# Altium project Voltage supply of sEMG & ADC.PrjPcb
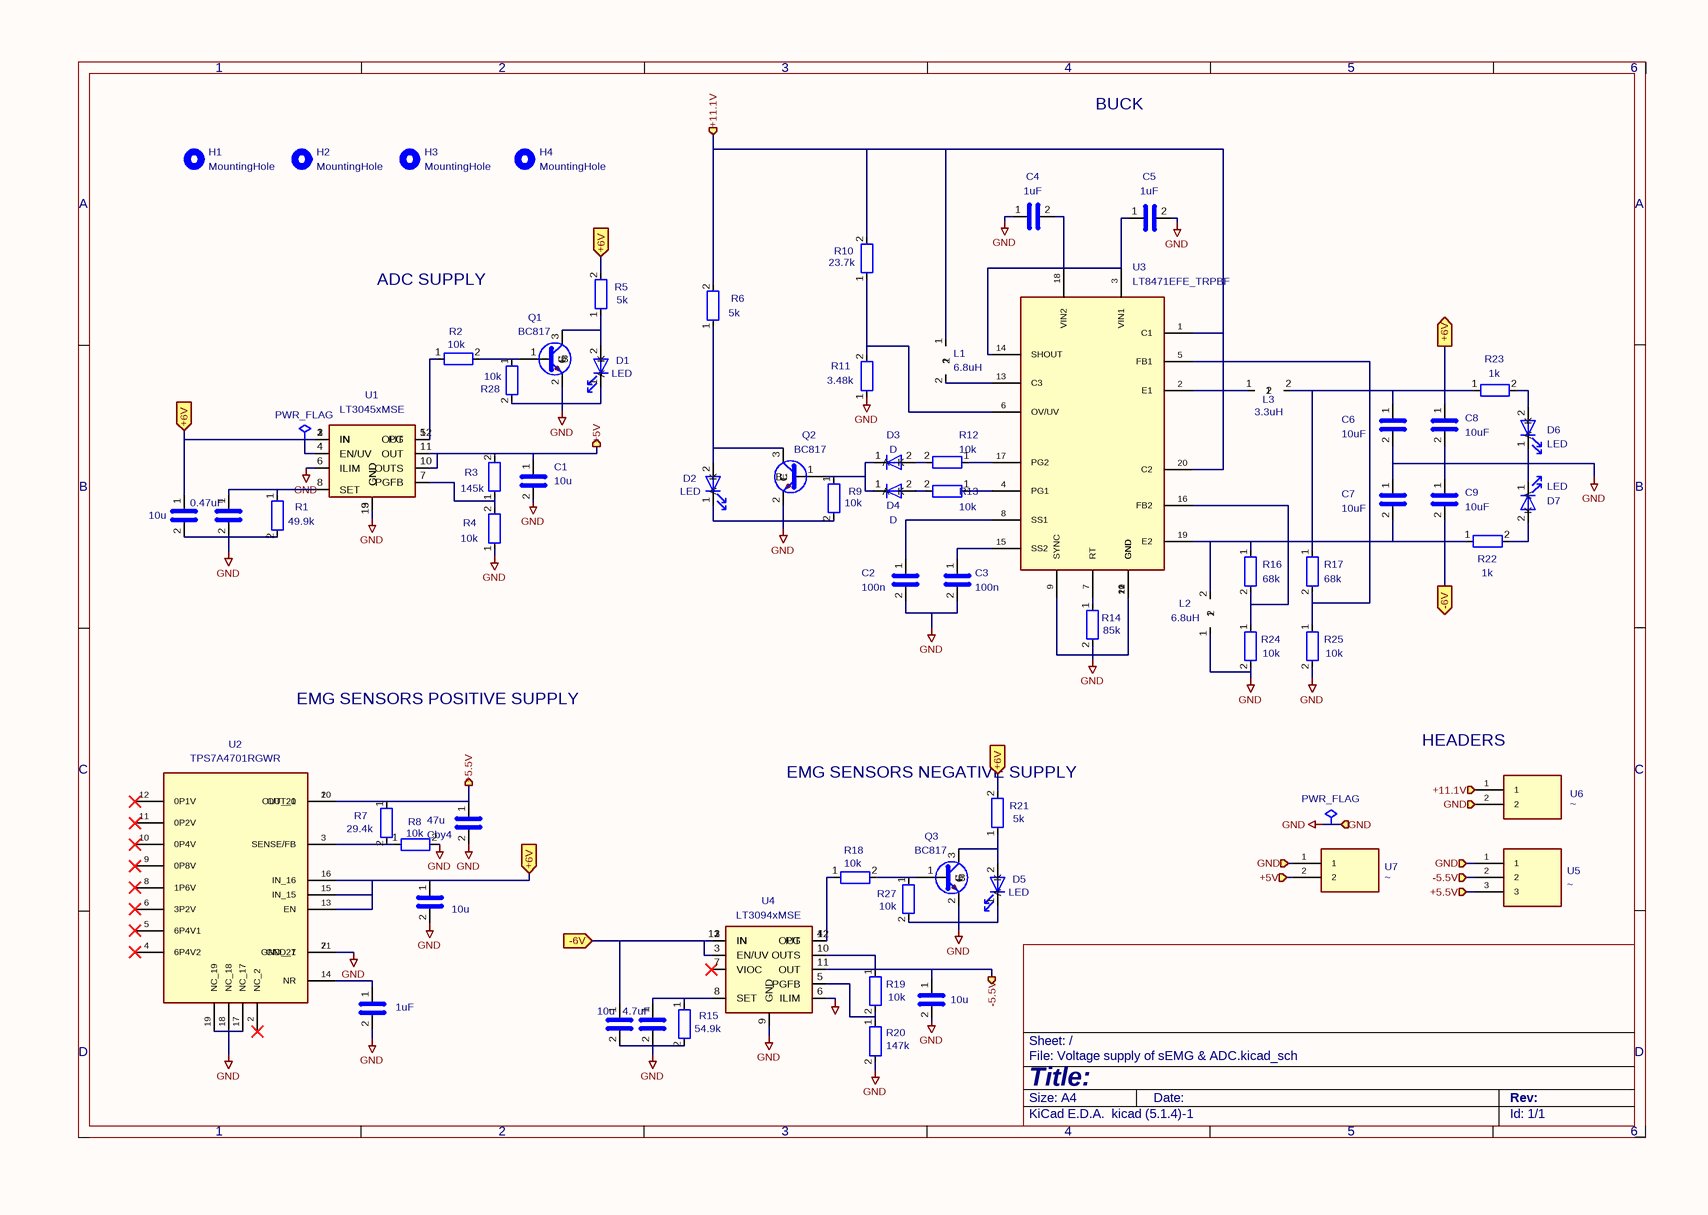
[diagram p0: Voltage supply of sEMG & ADC.SchDoc]
4 sheets, 189 parts. Net scope: flat (ports and power ports of the same name join across sheets).
Board files: Voltage supply of sEMG & ADC.PcbDoc, Voltage supply of sEMG & ADC(1).PcbDoc, ADC.PcbDoc, ADC(1).PcbDoc, BMS.PcbDoc, BMS(1).PcbDoc, EMG sensors.PcbDoc, EMG sensors(1).PcbDoc
Sheets:
  Voltage supply of sEMG & ADC.SchDoc
  ADC.SchDoc
  BMS.SchDoc
  EMG sensors.SchDoc

## Sheet Voltage supply of sEMG & ADC.SchDoc
size 297 x 209 mm

### Parts
(Parts that share a designator on the sheet are numbered #1, #2 ... from top to bottom, then left to right.)
#FLG01#1  PWR_FLAG  (graphical)
#FLG02#1  PWR_FLAG  (graphical)
C1#1  10u  [C_0805_2012Metric_Pad1.18x1.45mm_HandSolder]
C2#1  100n  [C_0402_1005Metric_Pad0.74x0.62mm_HandSolder]
C2in1  1uF  [C_0402_1005Metric_Pad0.74x0.62mm_HandSolder]
C3#1  100n  [C_0402_1005Metric_Pad0.74x0.62mm_HandSolder]
C4#1  1uF  [C_0603_1608Metric_Pad1.08x0.95mm_HandSolder]
C5#1  1uF  [C_0603_1608Metric_Pad1.08x0.95mm_HandSolder]
C6#1  10uF  [C_0805_2012Metric_Pad1.18x1.45mm_HandSolder]
C7#1  10uF  [C_0805_2012Metric_Pad1.18x1.45mm_HandSolder]
C8#1  10uF  [C_0805_2012Metric_Pad1.18x1.45mm_HandSolder]
C9#1  10uF  [C_0805_2012Metric_Pad1.18x1.45mm_HandSolder]
Cby1  10u  [C_0805_2012Metric_Pad1.18x1.45mm_HandSolder]
Cby2  0.47uF  [C_0805_2012Metric_Pad1.18x1.45mm_HandSolder]
Cby3  10u  [C_0805_2012Metric_Pad1.18x1.45mm_HandSolder]
Cby4  47u  [C_1210_3225Metric_Pad1.33x2.70mm_HandSolder]
Cby5  10u  [C_0805_2012Metric_Pad1.18x1.45mm_HandSolder]
Cby6  4.7uF  [C_0805_2012Metric_Pad1.18x1.45mm_HandSolder]
Cby7  10u  [C_0805_2012Metric_Pad1.18x1.45mm_HandSolder]
D1#1  LED  [LED_0603_1608Metric_Pad1.05x0.95mm_HandSolder]
D2#1  LED  [LED_0603_1608Metric_Pad1.05x0.95mm_HandSolder]
D3#1  D  [D_SOD-123]
D4  D  [D_SOD-123]
D5  LED  [LED_0603_1608Metric_Pad1.05x0.95mm_HandSolder]
D6  LED  [LED_0603_1608Metric_Pad1.05x0.95mm_HandSolder]
D7  LED  [LED_0603_1608Metric_Pad1.05x0.95mm_HandSolder]
H1#1  MountingHole  [MountingHole_2.7mm_M2.5_DIN965]
H2#1  MountingHole  [MountingHole_2.7mm_M2.5_DIN965]
H3#1  MountingHole  [MountingHole_2.7mm_M2.5_DIN965]
H4#1  MountingHole  [MountingHole_2.7mm_M2.5_DIN965]
L1  6.8uH  [L_Coilcraft_XAL7030-102]
L2  6.8uH  [L_Coilcraft_XAL7030-102]
L3  3.3uH  [L_Coilcraft_XAL5030-XXX]
Q1#1  BC817  [SOT-23]
Q2#1  BC817  [SOT-23]
Q3#1  BC817  [SOT-23]
R1#1  49.9k  [R_0603_1608Metric_Pad0.98x0.95mm_HandSolder]
R2#1  10k  [R_0402_1005Metric_Pad0.72x0.64mm_HandSolder]
R3#1  145k  [R_0603_1608Metric_Pad0.98x0.95mm_HandSolder]
R4#1  10k  [R_0402_1005Metric_Pad0.72x0.64mm_HandSolder]
R5#1  5k  [R_0603_1608Metric_Pad0.98x0.95mm_HandSolder]
R6#1  5k  [R_0603_1608Metric_Pad0.98x0.95mm_HandSolder]
R7#1  29.4k  [R_0402_1005Metric_Pad0.72x0.64mm_HandSolder]
R8#1  10k  [R_0402_1005Metric_Pad0.72x0.64mm_HandSolder]
R9#1  10k  [R_0402_1005Metric_Pad0.72x0.64mm_HandSolder]
R10#1  23.7k  [R_0402_1005Metric_Pad0.72x0.64mm_HandSolder]
R11#1  3.48k  [R_0603_1608Metric_Pad0.98x0.95mm_HandSolder]
R12#1  10k  [R_0402_1005Metric_Pad0.72x0.64mm_HandSolder]
R13#1  10k  [R_0402_1005Metric_Pad0.72x0.64mm_HandSolder]
R14#1  85k  [R_0603_1608Metric_Pad0.98x0.95mm_HandSolder]
R15#1  54.9k  [R_0603_1608Metric_Pad0.98x0.95mm_HandSolder]
R16#1  68k  [R_0603_1608Metric_Pad0.98x0.95mm_HandSolder]
R17#1  68k  [R_0603_1608Metric_Pad0.98x0.95mm_HandSolder]
R18#1  10k  [R_0402_1005Metric_Pad0.72x0.64mm_HandSolder]
R19#1  10k  [R_0402_1005Metric_Pad0.72x0.64mm_HandSolder]
R20  147k  [R_0603_1608Metric_Pad0.98x0.95mm_HandSolder]
R21  5k  [R_0603_1608Metric_Pad0.98x0.95mm_HandSolder]
R22  1k  [R_0603_1608Metric_Pad0.98x0.95mm_HandSolder]
R23  1k  [R_0603_1608Metric_Pad0.98x0.95mm_HandSolder]
R24  10k  [R_0603_1608Metric_Pad0.98x0.95mm_HandSolder]
R25  10k  [R_0603_1608Metric_Pad0.98x0.95mm_HandSolder]
R27  10k  [R_0603_1608Metric_Pad0.98x0.95mm_HandSolder]
R28  10k  [R_0603_1608Metric_Pad0.98x0.95mm_HandSolder]
U1#1  LT3045xMSE  [MSOP-12-1EP_3x4.039mm_P0.65mm_EP1.651x2.845mm]
U2#1  TPS7A4701RGWR  [QFN65P500X500X100-21N]
U3#1  LT8471EFE_TRPBF  [SOP65P640X120-21N]
U4#1  LT3094xMSE  [MSOP-12-1EP_3x4.039mm_P0.65mm_EP1.651x2.845mm]
U5#1  ~  [JST_GH_SM03B-GHS-TB_1x03-1MP_P1.25mm_Horizontal]
U6#1  ~  [JST_GH_SM02B-GHS-TB_1x02-1MP_P1.25mm_Horizontal]
U7#1  ~  [JST_GH_SM02B-GHS-TB_1x02-1MP_P1.25mm_Horizontal]

### Ports
+5.5V (in), +5.5V (out), +5V (in), +5V (out), +6V (in), +6V (out), +11.1V (in), +11.1V (out), -5.5V (in), -5.5V (out), -6V (in), -6V (out), GND (in), GND (out)

### Nets
GND: #FLG01#1.1 C1#1.2 C2#1.2 C2in1.2 C3#1.2 C4#1.1 C5#1.2 C6#1.2 C7#1.1 C8#1.2 C9#1.1 Cby1.2 Cby2.2 Cby3.2 Cby4.2 Cby5.2 Cby6.2 Cby7.2 D1#1.1(K) D2#1.1(K) D5.1(K) D6.1(K) D7.1(K) L2.1 Q1#1.2(E) Q2#1.2(E) Q3#1.2(E) R1#1.2 R4#1.1 R8#1.2 R9#1.2 R11#1.1 R14#1.2 R15#1.2 R20.2 R24.2 R25.2 R27.2 R28.2 U1#1.6(ILIM) U1#1.9(GND) U1#1.13(GND) U2#1.7(GND_7) U2#1.17(NC_17) U2#1.18(NC_18) U2#1.19(NC_19) U2#1.21(GND_21) U3#1.9(SYNC) U3#1.10(GND) U3#1.11(GND) U3#1.12(GND) U3#1.21(GND) U4#1.6(ILIM) U4#1.9(GND) U5#1.1 U6#1.2 U7#1.1 ; port GND
+5.5V: Cby4.1 R7#1.1 U2#1.1(OUT_1) U2#1.20(OUT_20) U5#1.3 ; port +5.5V
+5V: C1#1.1 R3#1.2 U1#1.10(OUTS) U1#1.11(OUT) U7#1.2 ; port +5V
+6V: #FLG02#1.1 C6#1.1 C8#1.1 Cby1.1 Cby3.1 L3.2 R5#1.2 R17#1.1 R21.2 R23.1 U1#1.1(IN) U1#1.2(IN) U1#1.3(IN) U1#1.4(EN/UV) U2#1.13(EN) U2#1.15(IN_15) U2#1.16(IN_16) ; port +6V
+11.1V: L1.1 R6#1.2 R10#1.2 U3#1.1(C1) U3#1.20(C2) U6#1.1 ; port +11.1V
-5.5V: Cby7.1 R19#1.1 U4#1.10(OUTS) U4#1.11(OUT) U5#1.2 ; port -5.5V
-6V: C7#1.2 C9#1.2 Cby5.1 L2.2 R16#1.1 R22.1 U3#1.19(E2) U4#1.1(IN) U4#1.2(IN) U4#1.3(EN/UV) U4#1.13(IN) ; port -6V
NetC2#1_1: C2#1.1 U3#1.8(SS1)
NetC2in1_1: C2in1.1 U2#1.14(NR)
NetC3#1_1: C3#1.1 U3#1.15(SS2)
NetC4#1_2: C4#1.2 C5#1.1 U3#1.3(VIN1) U3#1.14(SHOUT) U3#1.18(VIN2)
NetCby2_1: Cby2.1 R1#1.1 U1#1.8(SET)
NetCby6_1: Cby6.1 R15#1.1 U4#1.8(SET)
NetD1#1_2: D1#1.2(A) Q1#1.3(C) R5#1.1
NetD2#1_2: D2#1.2(A) Q2#1.3(C) R6#1.1
NetD3#1_1: D3#1.1(K) D4.1(K) Q2#1.1(B) R9#1.1
NetD3#1_2: D3#1.2(A) R12#1.2
NetD4_2: D4.2(A) R13#1.2
NetD5_2: D5.2(A) Q3#1.3(C) R21.1
NetD6_2: D6.2(A) R23.2
NetD7_2: D7.2(A) R22.2
NetL1_2: L1.2 U3#1.13(C3)
NetL3_1: L3.1 U3#1.2(E1)
NetQ1#1_1: Q1#1.1(B) R2#1.2 R28.1
NetQ3#1_1: Q3#1.1(B) R18#1.2 R27.1
NetR2#1_1: R2#1.1 U1#1.5(PG) U1#1.12(OUT)
NetR3#1_1: R3#1.1 R4#1.2 U1#1.7(PGFB)
NetR7#1_2: R7#1.2 R8#1.1 U2#1.3(SENSE/FB)
NetR10#1_1: R10#1.1 R11#1.2 U3#1.6(OV/UV)
NetR12#1_1: R12#1.1 U3#1.17(PG2)
NetR13#1_1: R13#1.1 U3#1.4(PG1)
NetR14#1_1: R14#1.1 U3#1.7(RT)
NetR16#1_2: R16#1.2 R24.1 U3#1.16(FB2)
NetR17#1_2: R17#1.2 R25.1 U3#1.5(FB1)
NetR18#1_1: R18#1.1 U4#1.4(PG) U4#1.12(OUT)
NetR19#1_2: R19#1.2 R20.1 U4#1.5(PGFB)

Not connected (* = marked no-connect by the designer): U2#1 2(NC_2)* 4(6P4V2)* 5(6P4V1)* 6(3P2V)* 8(1P6V)* 9(0P8V)* 10(0P4V)* 11(0P2V)* 12(0P1V)*; U4#1 7(VIOC)*

### Notes on the sheet
- BUCK
- ADC SUPPLY
- EMG SENSORS POSITIVE SUPPLY
- (near R21) EMG SENSORS NEGATIVE SUPPLY
- (near U6#1) HEADERS
- 1
- 2
- 3
- 4
- 5
- 6
- A
- B
- C
- D
- Title:
- File: Voltage supply of sEMG & ADC.kicad_sch
- Sheet: /
- KiCad E.D.A.  kicad (5.1.4)-1
- Size: A4
- Date:
- Rev:
- Id: 1/1

### Library data of the parts
#FLG01#1 #FLG02#1 = PWR_FLAG: Description: Special symbol for telling ERC where power comes from; Value: PWR_FLAG
C1#1 C2#1 C2in1 C3#1 C4#1 C5#1 C6#1 C7#1 C8#1 C9#1 Cby1-Cby7 = C: Description: Unpolarized capacitor
  C1#1 Cby1 Cby3 Cby5 Cby7: Value: 10u; Footprint: Capacitor_SMD:C_0805_2012Metric_Pad1.18x1.45mm_HandSolder
  C2#1 C3#1: Value: 100n; Footprint: Capacitor_SMD:C_0402_1005Metric_Pad0.74x0.62mm_HandSolder
  C2in1: Value: 1uF; Footprint: Capacitor_SMD:C_0402_1005Metric_Pad0.74x0.62mm_HandSolder
  C4#1 C5#1: Value: 1uF; Footprint: Capacitor_SMD:C_0603_1608Metric_Pad1.08x0.95mm_HandSolder
  C6#1 C7#1 C8#1 C9#1: Value: 10uF; Footprint: Capacitor_SMD:C_0805_2012Metric_Pad1.18x1.45mm_HandSolder
  Cby2: Value: 0.47uF; Footprint: Capacitor_SMD:C_0805_2012Metric_Pad1.18x1.45mm_HandSolder
  Cby4: Value: 47u; Footprint: Capacitor_SMD:C_1210_3225Metric_Pad1.33x2.70mm_HandSolder
  Cby6: Value: 4.7uF; Footprint: Capacitor_SMD:C_0805_2012Metric_Pad1.18x1.45mm_HandSolder
D1#1 D2#1 D5-D7 = LED: Description: Light emitting diode; Value: LED; Footprint: LED_SMD:LED_0603_1608Metric_Pad1.05x0.95mm_HandSolder
D3#1 D4 = D: Description: Diode; Sim.Pins: 1=K 2=A; Sim.Device: D; Value: D; Footprint: Diode_SMD:D_SOD-123
H1#1 H2#1 H3#1 H4#1 = MountingHole: Description: Mounting Hole without connection; Value: MountingHole; Footprint: MountingHole:MountingHole_2.7mm_M2.5_DIN965
L1-L3 = L: Description: Inductor
  L1: Website: https://www.digikey.com/en/products/detail/coilcraft/LPS4018-682MRC/12714582; Value: 6.8uH; Footprint: Inductor_SMD:L_Coilcraft_XAL7030-102
  L2: Website: https://www.digikey.com/en/products/detail/w%C3%BCrth-elektronik/74437324068/2791049; Value: 6.8uH; Footprint: Inductor_SMD:L_Coilcraft_XAL7030-102
  L3: Website: https://www.digikey.com/en/products/detail/w%C3%BCrth-elektronik/74437324033/2791046; Value: 3.3uH; Footprint: Inductor_SMD:L_Coilcraft_XAL5030-XXX
Q1#1 Q2#1 Q3#1 = BC817: Description: 0.8A Ic, 45V Vce, NPN Transistor, SOT-23; Value: BC817; Footprint: Package_TO_SOT_SMD:SOT-23
R1#1 R2#1 R3#1 R4#1 R5#1 R6#1 R7#1 R8#1 R9#1 R10#1 R11#1 R12#1 R13#1 R14#1 R15#1 R16#1 R17#1 R18#1 R19#1 R20-R25 R27 R28 = R: Description: Resistor
  R1#1: Value: 49.9k; Footprint: Resistor_SMD:R_0603_1608Metric_Pad0.98x0.95mm_HandSolder
  R2#1 R4#1 R8#1 R9#1 R12#1 R13#1 R18#1 R19#1: Value: 10k; Footprint: Resistor_SMD:R_0402_1005Metric_Pad0.72x0.64mm_HandSolder
  R3#1: Value: 145k; Footprint: Resistor_SMD:R_0603_1608Metric_Pad0.98x0.95mm_HandSolder
  R5#1 R6#1 R21: Value: 5k; Footprint: Resistor_SMD:R_0603_1608Metric_Pad0.98x0.95mm_HandSolder
  R7#1: Value: 29.4k; Footprint: Resistor_SMD:R_0402_1005Metric_Pad0.72x0.64mm_HandSolder
  R10#1: Website: https://www.digikey.be/en/products/detail/stackpole-electronics-inc/RMCF0402FT23K7/1714563; Value: 23.7k; Footprint: Resistor_SMD:R_0402_1005Metric_Pad0.72x0.64mm_HandSolder
  R11#1: Website: https://www.digikey.in/en/products/detail/yageo/RC0402FR-073K48L/5281008; Value: 3.48k; Footprint: Resistor_SMD:R_0603_1608Metric_Pad0.98x0.95mm_HandSolder
  R14#1: Value: 85k; Footprint: Resistor_SMD:R_0603_1608Metric_Pad0.98x0.95mm_HandSolder
  R15#1: Value: 54.9k; Footprint: Resistor_SMD:R_0603_1608Metric_Pad0.98x0.95mm_HandSolder
  R16#1 R17#1: Website: https://www.digikey.com/en/products/detail/susumu/RG1608P-683-B-T5/1228890; Value: 68k; Footprint: Resistor_SMD:R_0603_1608Metric_Pad0.98x0.95mm_HandSolder
  R20: Value: 147k; Footprint: Resistor_SMD:R_0603_1608Metric_Pad0.98x0.95mm_HandSolder
  R22 R23: Value: 1k; Footprint: Resistor_SMD:R_0603_1608Metric_Pad0.98x0.95mm_HandSolder
  R24 R25 R27 R28: Website: https://www.digikey.lv/en/products/detail/panasonic-electronic-components/ERA-3AEB103V/1465878; Value: 10k; Footprint: Resistor_SMD:R_0603_1608Metric_Pad0.98x0.95mm_HandSolder
U1#1 = LT3045xMSE: Description: 500mA, Adjustable, Ultralow Noise, Ultrahigh PSRR Linear Regulator, MSOP-12; Value: LT3045xMSE; Footprint: Package_SO:MSOP-12-1EP_3x4.039mm_P0.65mm_EP1.651x2.845mm
U3#1 = LT8471EFE_TRPBF: MF: Analog Devices; MP: LT8471EFE#TRPBF; Description_1: \n                        \n                            Dual Multitopology DC/DC Converters with 2A Switches and Synchronization\n                        \n; MAXIMUM_PACKAGE_HEIGHT: 1.2 mm; Package: TSSOP -20 Analog Devices; Price: None; Check_prices: https://www.snapeda.com/parts/LT8471EFE%23TRPBF/Analog+Devices/view-part/?ref=eda; STANDARD: IPC-7351B; PARTREV: D; SnapEDA_Link: https://www.snapeda.com/parts/LT8471EFE%23TRPBF/Analog+Devices/view-part/?ref=snap; Availability: In Stock; MANUFACTURER: Analog Devices; Value: LT8471EFE_TRPBF; Footprint: BUCK:SOP65P640X120-21N
U4#1 = LT3094xMSE: Description: -500mA, Adjustable, Ultralow Noise, Ultrahigh PSRR RF Negative Linear Regulator, MSOP-12; Value: LT3094xMSE; Footprint: Package_SO:MSOP-12-1EP_3x4.039mm_P0.65mm_EP1.651x2.845mm
U5#1 = H_3: Value: ~; Footprint: Connector_JST:JST_GH_SM03B-GHS-TB_1x03-1MP_P1.25mm_Horizontal
U6#1 U7#1 = H_2: Value: ~; Footprint: Connector_JST:JST_GH_SM02B-GHS-TB_1x02-1MP_P1.25mm_Horizontal
U2#1 = TPS7A4701RGWR: Value: TPS7A4701RGWR; Footprint: BUCK:QFN65P500X500X100-21N

## Sheet ADC.SchDoc
size 297 x 209 mm
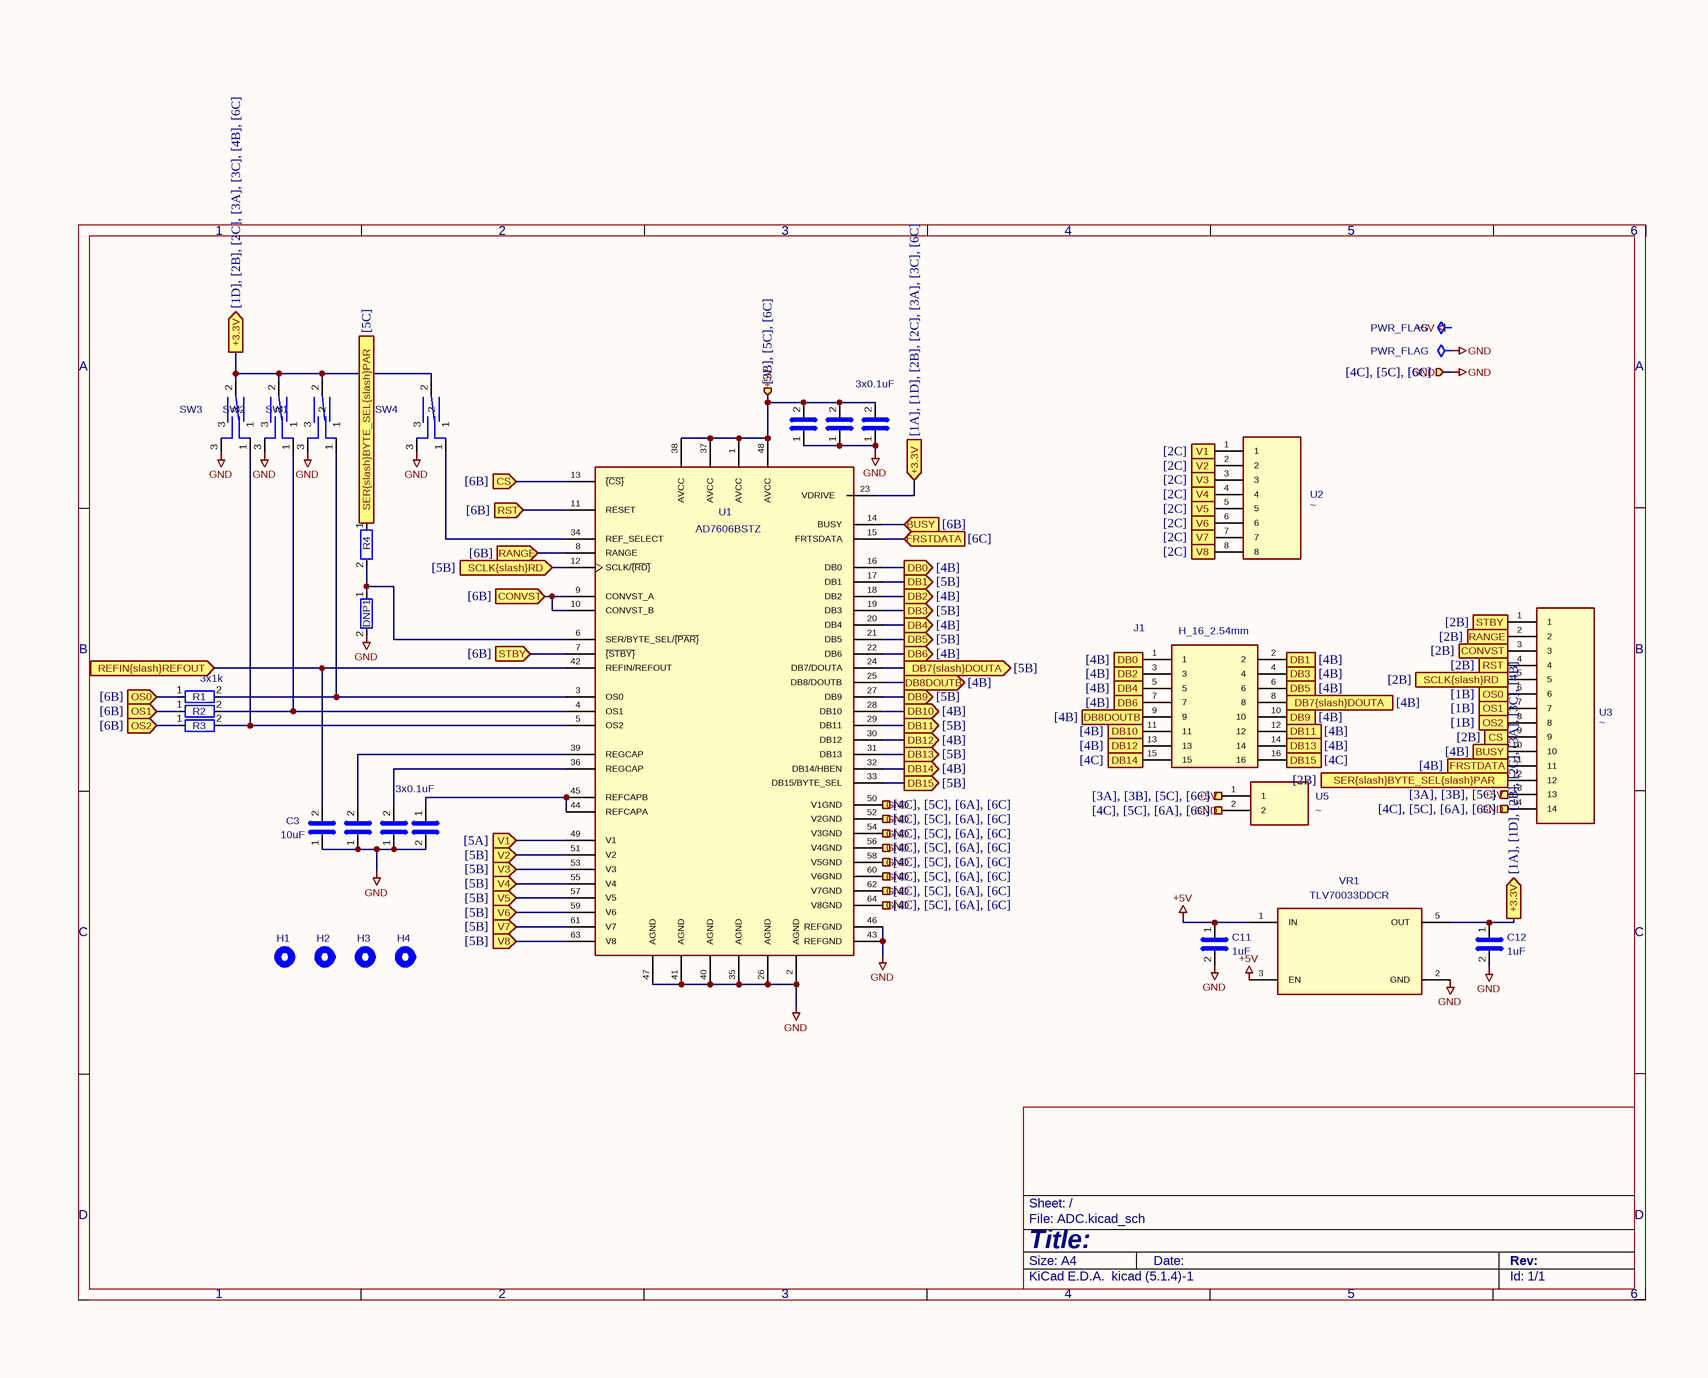
[diagram p1: ADC.SchDoc]

### Parts
(Parts that share a designator on the sheet are numbered #1, #2 ... from top to bottom, then left to right.)
#FLG02#2  PWR_FLAG  (graphical)
#FLG03  PWR_FLAG  (graphical)
C2#2  1uF  [C_0402_1005Metric_Pad0.74x0.62mm_HandSolder]  (value not drawn)
C3#2  10uF  [C_0805_2012Metric_Pad1.18x1.45mm_HandSolder]
C4#2  0.1uF  [C_0402_1005Metric_Pad0.74x0.62mm_HandSolder]  (value not drawn)
C6#2  1uF  [C_0402_1005Metric_Pad0.74x0.62mm_HandSolder]  (value not drawn)
C7#2  1uF  [C_0402_1005Metric_Pad0.74x0.62mm_HandSolder]  (value not drawn)
C8#2  0.1uF  [C_0402_1005Metric_Pad0.74x0.62mm_HandSolder]  (value not drawn)
C9#2  0.1uF  [C_0402_1005Metric_Pad0.74x0.62mm_HandSolder]  (value not drawn)
C11#1  1uF  [C_0402_1005Metric_Pad0.74x0.62mm_HandSolder]
C12#1  1uF  [C_0402_1005Metric_Pad0.74x0.62mm_HandSolder]
DNP1  10-47k  [R_0805_2012Metric_Pad1.20x1.40mm_HandSolder]  (value not drawn)
H1#2  MountingHole  [MountingHole_2.7mm_M2.5]  (value not drawn)
H2#2  MountingHole  [MountingHole_2.7mm_M2.5]  (value not drawn)
H3#2  MountingHole  [MountingHole_2.7mm_M2.5]  (value not drawn)
H4#2  MountingHole  [MountingHole_2.7mm_M2.5]  (value not drawn)
J1#1  H_16_2.54mm  [JST_SUR_SM16B-SURS-TF_1x16-1MP_P0.80mm_Horizontal]
R1#2  1k  [R_0402_1005Metric_Pad0.72x0.64mm_HandSolder]  (value not drawn)
R2#2  1k  [R_0402_1005Metric_Pad0.72x0.64mm_HandSolder]  (value not drawn)
R3#2  1k  [R_0402_1005Metric_Pad0.72x0.64mm_HandSolder]  (value not drawn)
R4#2  1k  [R_0805_2012Metric_Pad1.20x1.40mm_HandSolder]  (value not drawn)
SW1#1  SW_Reed_SPDT  [switch1]  (value not drawn)
SW2#1  SW_Reed_SPDT  [switch1]  (value not drawn)
SW3#1  SW_Reed_SPDT  [switch1]  (value not drawn)
SW4  SW_Reed_SPDT  [switch1]  (value not drawn)
U1#2  AD7606BSTZ  [AD7606BSTZ]
U2#2  ~  [JST_GH_SM08B-GHS-TB_1x08-1MP_P1.25mm_Horizontal]
U3#2  ~  [PinHeader_1x14_P2.54mm_Vertical]
U5#2  ~  [JST_GH_SM02B-GHS-TB_1x02-1MP_P1.25mm_Horizontal]
VR1#1  TLV70033DDCR  [TLV70033DDCR]

### Ports
+3.3V (in, see [1A], [1D], [2B], [2C], [3A], [3C], [6C]), +3.3V (out, see [1A], [1D], [2B], [2C], [3A], [3C], [4B]), +3.3V (out, see [1D], [2B], [2C], [3A], [3C], [4B], [6C]), +5V (in, see [3B], [5C], [6C]), +5V (out, see [3A], [3B], [5C]), +5V (out, see [3A], [3B], [5C], [6C]), BUSY (in, see [6B]), BUSY (out, see [4B]), CONVST (in, see [6B]), CONVST (out, see [2B]), CS (in, see [6B]), CS (out, see [2B]), DB0 (in, see [4B]), DB0 (out, see [4B]), DB1 (in, see [4B]), DB1 (out, see [5B]), DB2 (in, see [4B]), DB2 (out, see [4B]), DB3 (in, see [4B]), DB3 (out, see [5B]), DB4 (in, see [4B]), DB4 (out, see [4B]), DB5 (in, see [4B]), DB5 (out, see [5B]), DB6 (in, see [4B]), DB6 (out, see [4B]), DB7{slash}DOUTA (in, see [4B]), DB7{slash}DOUTA (out, see [5B]), DB8DOUTB (in, see [4B]), DB8DOUTB (out, see [4B]), DB9 (in, see [4B]), DB9 (out, see [5B]), DB10 (in, see [4B]), DB10 (out, see [4B]), DB11 (in, see [4B]), DB11 (out, see [5B]), DB12 (in, see [4B]), DB12 (out, see [4B]), DB13 (in, see [4B]), DB13 (out, see [5B]), DB14 (in, see [4C]), DB14 (out, see [4B]), DB15 (in, see [4C]), DB15 (out, see [5B]), FRSTDATA (in, see [6C]), FRSTDATA (out, see [4B]), GND (in, see [4C], [5C], [6A], [6C]), GND (in, see [4C], [5C], [6C]), GND (out, see [4C], [5C], [6A], [6C]), OS0 (in, see [6B]), OS0 (out, see [1B]), OS1 (in, see [6B]), OS1 (out, see [1B]), OS2 (in, see [6B]), OS2 (out, see [1B]), RANGE (in, see [6B]), RANGE (out, see [2B]), REFIN{slash}REFOUT (in), RST (in, see [6B]), RST (out, see [2B]), SCLK{slash}RD (in, see [5B]), SCLK{slash}RD (out, see [2B]), SER{slash}BYTE_SEL{slash}PAR (in, see [5C]), SER{slash}BYTE_SEL{slash}PAR (out, see [2B]), STBY (in, see [6B]), STBY (out, see [2B]), V1 (in, see [5A]), V1 (out, see [2C]), V2 (in, see [5B]), V2 (out, see [2C]), V3 (in, see [5B]), V3 (out, see [2C]), V4 (in, see [5B]), V4 (out, see [2C]), V5 (in, see [5B]), V5 (out, see [2C]), V6 (in, see [5B]), V6 (out, see [2C]), V7 (in, see [5B]), V7 (out, see [2C]), V8 (in, see [5B]), V8 (out, see [2C])

### Nets
+5V: #FLG03.1 C11#1.1 VR1#1.1(IN) VR1#1.3(EN)
GND: #FLG02#2.1 C2#2.1 C3#2.1 C4#2.1 C6#2.1 C7#2.2 C8#2.1 C9#2.1 C11#1.2 C12#1.2 DNP1.2 SW1#1.3 SW2#1.3 SW3#1.3 SW4.3 U1#2.2(AGND) U1#2.26(AGND) U1#2.35(AGND) U1#2.40(AGND) U1#2.41(AGND) U1#2.43(REFGND) U1#2.46(REFGND) U1#2.47(AGND) U1#2.50(V1GND) U1#2.52(V2GND) U1#2.54(V3GND) U1#2.56(V4GND) U1#2.58(V5GND) U1#2.60(V6GND) U1#2.62(V7GND) U1#2.64(V8GND) U3#2.14 U5#2.2 VR1#1.2(GND) ; port GND
+3.3V: C12#1.1 SW1#1.2 SW2#1.2 SW3#1.2 SW4.2 U1#2.23(VDRIVE) VR1#1.5(OUT) ; port +3.3V
+5V: C4#2.2 C8#2.2 C9#2.2 U1#2.1(AVCC) U1#2.37(AVCC) U1#2.38(AVCC) U1#2.48(AVCC) U3#2.13 U5#2.1 ; port +5V  [a separate net that carries the same name]
BUSY: U1#2.14(BUSY) U3#2.10 ; port BUSY
CONVST: U1#2.9(CONVST_A) U1#2.10(CONVST_B) U3#2.3 ; port CONVST
CS: U1#2.13(~{{CS}}) U3#2.9 ; port CS
DB0: J1#1.1 U1#2.16(DB0) ; port DB0
DB1: J1#1.2 U1#2.17(DB1) ; port DB1
DB2: J1#1.3 U1#2.18(DB2) ; port DB2
DB3: J1#1.4 U1#2.19(DB3) ; port DB3
DB4: J1#1.5 U1#2.20(DB4) ; port DB4
DB5: J1#1.6 U1#2.21(DB5) ; port DB5
DB6: J1#1.7 U1#2.22(DB6) ; port DB6
DB7{slash}DOUTA: J1#1.8 U1#2.24(DB7/DOUTA) ; port DB7{slash}DOUTA
DB8DOUTB: J1#1.9 U1#2.25(DB8/DOUTB) ; port DB8DOUTB
DB9: J1#1.10 U1#2.27(DB9) ; port DB9
DB10: J1#1.11 U1#2.28(DB10) ; port DB10
DB11: J1#1.12 U1#2.29(DB11) ; port DB11
DB12: J1#1.13 U1#2.30(DB12) ; port DB12
DB13: J1#1.14 U1#2.31(DB13) ; port DB13
DB14: J1#1.15 U1#2.32(DB14/HBEN) ; port DB14
DB15: J1#1.16 U1#2.33(DB15/BYTE_SEL) ; port DB15
FRSTDATA: U1#2.15(FRTSDATA) U3#2.11 ; port FRSTDATA
OS0: R1#2.1 U3#2.6 ; port OS0
OS1: R2#2.1 U3#2.7 ; port OS1
OS2: R3#2.1 U3#2.8 ; port OS2
RANGE: U1#2.8(RANGE) U3#2.2 ; port RANGE
REFIN{slash}REFOUT: C3#2.2 U1#2.42(REFIN/REFOUT) ; port REFIN{slash}REFOUT
RST: U1#2.11(RESET) U3#2.4 ; port RST
SCLK{slash}RD: U1#2.12(SCLK/~{{RD}}) U3#2.5 ; port SCLK{slash}RD
SER{slash}BYTE_SEL{slash}PAR: R4#2.1 U3#2.12 ; port SER{slash}BYTE_SEL{slash}PAR
STBY: U1#2.7(~{{STBY}}) U3#2.1 ; port STBY
V1: U1#2.49(V1) U2#2.1 ; port V1
V2: U1#2.51(V2) U2#2.2 ; port V2
V3: U1#2.53(V3) U2#2.3 ; port V3
V4: U1#2.55(V4) U2#2.4 ; port V4
V5: U1#2.57(V5) U2#2.5 ; port V5
V6: U1#2.59(V6) U2#2.6 ; port V6
V7: U1#2.61(V7) U2#2.7 ; port V7
V8: U1#2.63(V8) U2#2.8 ; port V8
NetC2#2_2: C2#2.2 U1#2.36(REGCAP)
NetC6#2_2: C6#2.2 U1#2.39(REGCAP)
NetC7#2_1: C7#2.1 U1#2.44(REFCAPA) U1#2.45(REFCAPB)
NetDNP1_1: DNP1.1 R4#2.2 U1#2.6(SER/BYTE_SEL/~{{PAR}})
NetR1#2_2: R1#2.2 SW1#1.1 U1#2.3(OS0)
NetR2#2_2: R2#2.2 SW2#1.1 U1#2.4(OS1)
NetR3#2_2: R3#2.2 SW3#1.1 U1#2.5(OS2)
NetSW4_1: SW4.1 U1#2.34(REF_SELECT)

### Notes on the sheet
- 3x0.1uF
- (near R1#2) 3x1k
- 1
- 2
- 3
- 4
- 5
- 6
- A
- B
- C
- D
- Title:
- File: ADC.kicad_sch
- Sheet: /
- KiCad E.D.A.  kicad (5.1.4)-1
- Size: A4
- Date:
- Rev:
- Id: 1/1

### Library data of the parts
#FLG02#2 #FLG03 = PWR_FLAG: as #FLG01#1 on sheet Voltage supply of sEMG & ADC; Value: PWR_FLAG
C2#2 C3#2 C4#2 C6#2 C7#2 C8#2 C9#2 C11#1 C12#1 = C: Description: Unpolarized capacitor
  C2#2 C6#2 C7#2 C11#1 C12#1: website: https://eu.mouser.com/ProductDetail/Murata-Electronics/GRM155Z71A105KE01D?qs=%252B6g0mu59x7LZ5VDL%2FTet%2Fg%3D%3D; Value: 1uF; Footprint: Capacitor_SMD:C_0402_1005Metric_Pad0.74x0.62mm_HandSolder
  C3#2: website: https://www.mouser.bg/ProductDetail/Murata-Electronics/GRM21BZ71E106KE15L?qs=Ey7%2FXF42M3fdXe9bIpCO9w%3D%3D; Value: 10uF; Footprint: Capacitor_SMD:C_0805_2012Metric_Pad1.18x1.45mm_HandSolder
  C4#2 C8#2 C9#2: website: https://www.mouser.bg/ProductDetail/Murata-Electronics/GRM155R71H104KE14D?qs=2UZY3JfgLCy9gG9icKV9Yg%3D%3D; Value: 0.1uF; Footprint: Capacitor_SMD:C_0402_1005Metric_Pad0.74x0.62mm_HandSolder
DNP1 R1#2 R2#2 R3#2 R4#2 = R: Description: Resistor
  DNP1: Value: 10-47k; Footprint: Resistor_SMD:R_0805_2012Metric_Pad1.20x1.40mm_HandSolder
  R1#2 R2#2 R3#2: website: https://www.digikey.bg/en/products/detail/yageo/RC0805FR-071KL/727444; Value: 1k; Footprint: Resistor_SMD:R_0402_1005Metric_Pad0.72x0.64mm_HandSolder
  R4#2: website: https://www.digikey.bg/en/products/detail/yageo/RC0805FR-071KL/727444; Value: 1k; Footprint: Resistor_SMD:R_0805_2012Metric_Pad1.20x1.40mm_HandSolder
H1#2 H2#2 H3#2 H4#2 = MountingHole: as H1#1 on sheet Voltage supply of sEMG & ADC; Value: MountingHole; Footprint: MountingHole:MountingHole_2.7mm_M2.5
J1#1 = MTSW-150-22-S-D-415: MF: Samtec; Description_1: \n                        \n                            MTSW - Samtec 2.54mm Variable Post Height Header  22 Lead Style\n                        \n; Package: None; Price: None; Check_prices: https://www.snapeda.com/parts/MTSW-150-22-S-D-415/Samtec/view-part/?ref=eda; STANDARD: Manufacturer Recommendations; PARTREV: R; SnapEDA_Link: https://www.snapeda.com/parts/MTSW-150-22-S-D-415/Samtec/view-part/?ref=snap; MP: MTSW-150-22-S-D-415; Availability: In Stock; MANUFACTURER: Samtec; Value: H_16_2.54mm; Footprint: Connector_JST:JST_SUR_SM16B-SURS-TF_1x16-1MP_P0.80mm_Horizontal
SW1#1 SW2#1 SW3#1 SW4 = SW_Reed_SPDT: Description: SPDT reed switch; website: https://www.digikey.bg/en/products/detail/e-switch/500SSP1S1M2REA/378941; Value: SW_Reed_SPDT; Footprint: Switches:switch1
U1#2 = AD7606BSTZ: MANUFACTURER: Analog Devices Inc.; MF: Analog Devices; SNAPEDA_PACKAGE_ID: 6381; Description_1: \n                        \n                            8-Channel DAS with 16-Bit, Bipolar Input, Simultaneous Sampling ADC\n                        \n; Package: LQFP -64 Analog Devices; Price: None; Check_prices: https://www.snapeda.com/parts/AD7606BSTZ/Analog+Devices/view-part/?ref=eda; SnapEDA_Link: https://www.snapeda.com/parts/AD7606BSTZ/Analog+Devices/view-part/?ref=snap; MP: AD7606BSTZ; Availability: In Stock; Value: AD7606BSTZ; Footprint: ADC:AD7606BSTZ; Supplier 1: Arrow Electronics; Supplier Part Number 1: AD7606BSTZ
U2#2 = H_8: Value: ~; Footprint: Connector_JST:JST_GH_SM08B-GHS-TB_1x08-1MP_P1.25mm_Horizontal
U3#2 = H_14: Value: ~; Footprint: Connector_PinHeader_2.54mm:PinHeader_1x14_P2.54mm_Vertical
U5#2 = H_2: Value: ~; Footprint: Connector_JST:JST_GH_SM02B-GHS-TB_1x02-1MP_P1.25mm_Horizontal
VR1#1 = TLV70033DDCR: MF: Texas Instruments; Description_1: \n                        \n                            200-mA, high-PSRR, low-IQ, low-dropout voltage regulator with enable\n                        \n; Package: SOT-23-THN-5 Texas Instruments; Price: None; SnapEDA_Link: https://www.snapeda.com/parts/TLV70033DDCR/Texas+Instruments/view-part/?ref=snap; MP: TLV70033DDCR; Availability: In Stock; Check_prices: https://www.snapeda.com/parts/TLV70033DDCR/Texas+Instruments/view-part/?ref=eda; Value: TLV70033DDCR; Footprint: LDOs:TLV70033DDCR

## Sheet BMS.SchDoc
size 297 x 209 mm
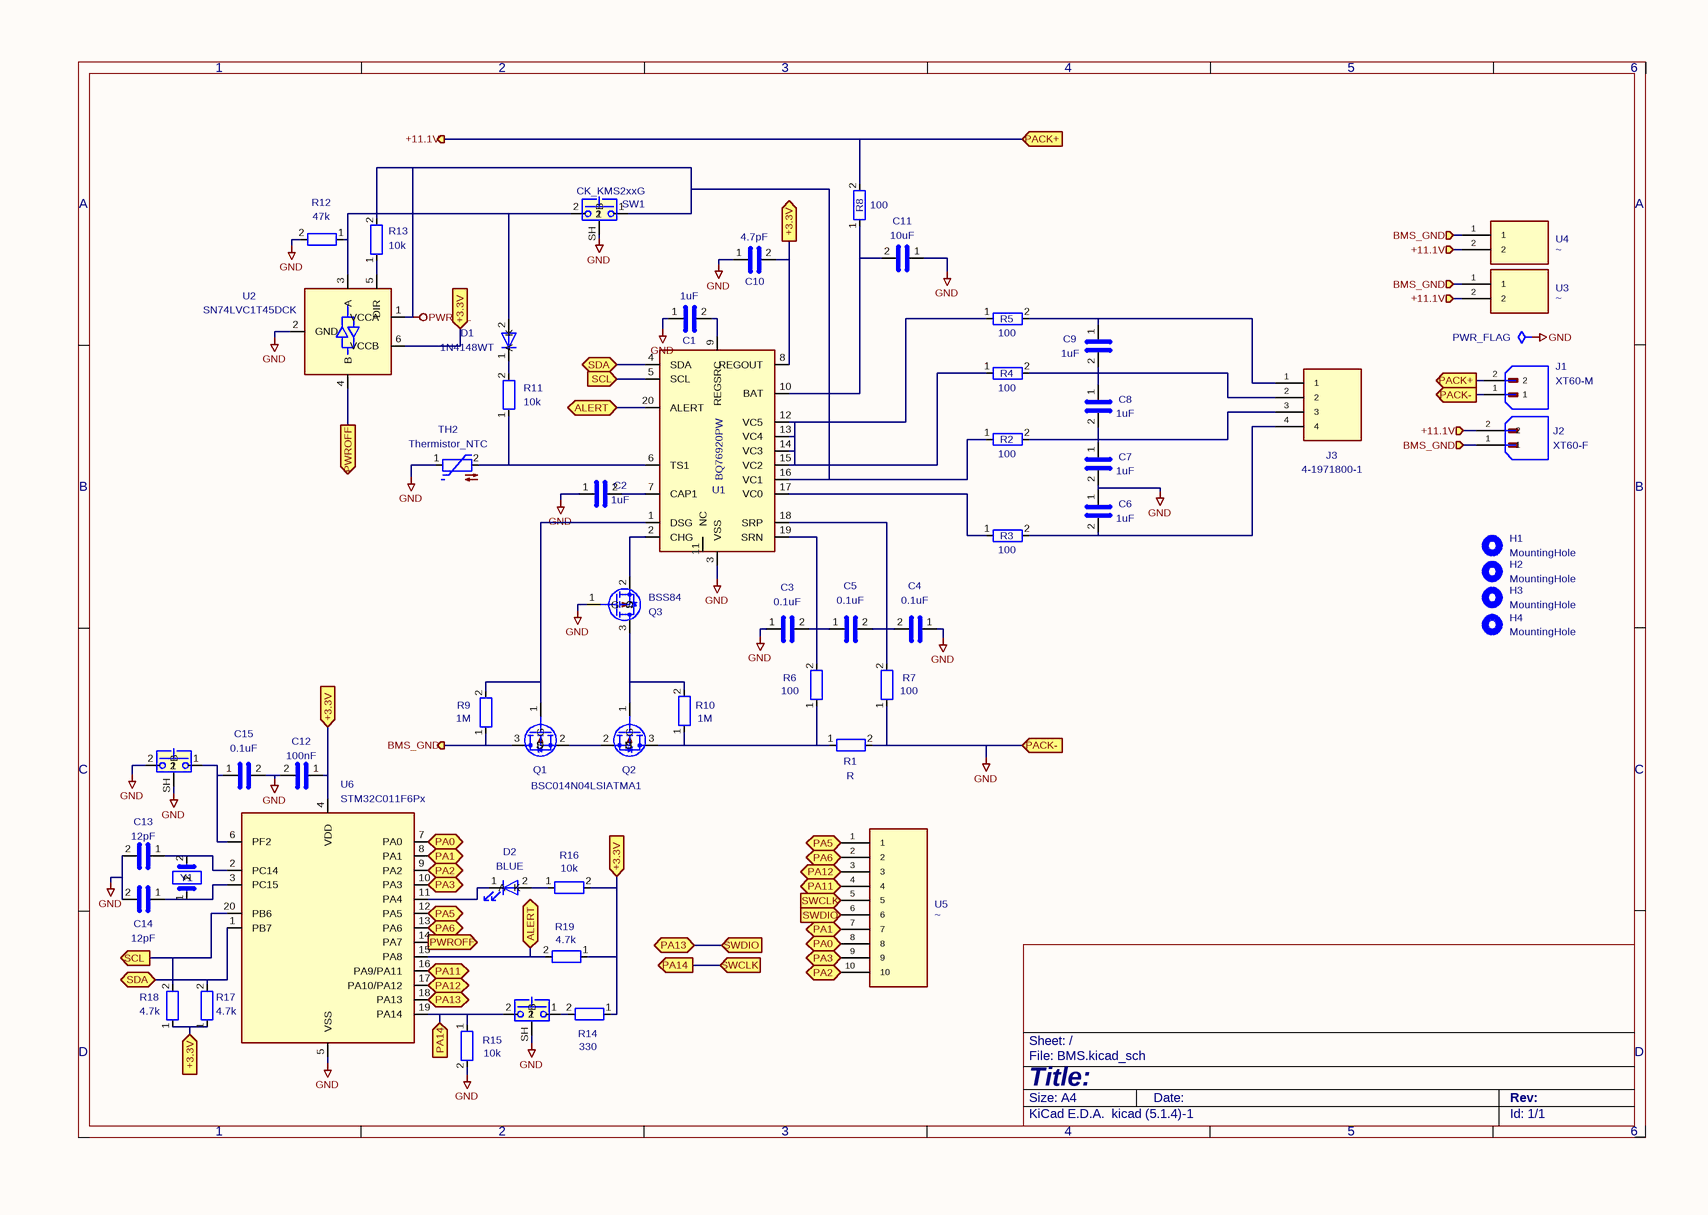
[diagram p2: BMS.SchDoc]

### Parts
(Parts that share a designator on the sheet are numbered #1, #2 ... from top to bottom, then left to right.)
#FLG02#3  PWR_FLAG  (graphical)
C1#2  1uF  [C_0603_1608Metric_Pad1.08x0.95mm_HandSolder]
C2#3  1uF  [C_0603_1608Metric_Pad1.08x0.95mm_HandSolder]
C3#3  0.1uF  [C_0603_1608Metric_Pad1.08x0.95mm_HandSolder]
C4#3  0.1uF  [C_0603_1608Metric_Pad1.08x0.95mm_HandSolder]
C5#2  0.1uF  [C_0603_1608Metric_Pad1.08x0.95mm_HandSolder]
C6#3  1uF  [C_0805_2012Metric_Pad1.18x1.45mm_HandSolder]
C7#3  1uF  [C_0805_2012Metric_Pad1.18x1.45mm_HandSolder]
C8#3  1uF  [C_0805_2012Metric_Pad1.18x1.45mm_HandSolder]
C9#3  1uF  [C_0805_2012Metric_Pad1.18x1.45mm_HandSolder]
C10#1  4.7pF  [C_0402_1005Metric_Pad0.74x0.62mm_HandSolder]
C11#2  10uF  [C_1210_3225Metric_Pad1.33x2.70mm_HandSolder]
C12#2  100nF  [C_0402_1005Metric_Pad0.74x0.62mm_HandSolder]
C13  12pF  [C_0603_1608Metric_Pad1.08x0.95mm_HandSolder]
C14  12pF  [C_0603_1608Metric_Pad1.08x0.95mm_HandSolder]
C15  0.1uF  [C_0402_1005Metric_Pad0.74x0.62mm_HandSolder]
D1#2  1N4148WT  [D_SOD-523]
D2#2  BLUE  [D_0603_1608Metric_Pad1.05x0.95mm_HandSolder]
H1#3  MountingHole  [MountingHole_3.2mm_M3_DIN965]
H2#3  MountingHole  [MountingHole_3.2mm_M3_DIN965]
H3#3  MountingHole  [MountingHole_3.2mm_M3_DIN965]
H4#3  MountingHole  [MountingHole_3.2mm_M3_DIN965]
J1#2  XT60-M  [AMASS_XT60PW-M_1x02_P7.20mm_Horizontal]
J2#1  XT60-F  [AMASS_XT60PW-F_1x02_P7.20mm_Horizontal]
J3#1  4-1971800-1  [JST_XH_S4B-XH-A_1x04_P2.50mm_Horizontal]
Q1#2  BSC014N04LSIATMA1  [TRANS_BSC014N04LSIATMA1]
Q2#2  BSC014N04LSIATMA1  [TRANS_BSC014N04LSIATMA1]  (value not drawn)
Q3#2  BSS84  [SOT-23]
R1#3  R  [R_3920]
R2#3  100  [R_0402_1005Metric_Pad0.72x0.64mm_HandSolder]
R3#3  100  [R_0402_1005Metric_Pad0.72x0.64mm_HandSolder]
R4#3  100  [R_0402_1005Metric_Pad0.72x0.64mm_HandSolder]
R5#2  100  [R_0402_1005Metric_Pad0.72x0.64mm_HandSolder]
R6#2  100  [R_0402_1005Metric_Pad0.72x0.64mm_HandSolder]
R7#2  100  [R_0402_1005Metric_Pad0.72x0.64mm_HandSolder]
R8#2  100  [R_0402_1005Metric_Pad0.72x0.64mm_HandSolder]
R9#2  1M  [R_0603_1608Metric_Pad0.98x0.95mm_HandSolder]
R10#2  1M  [R_0603_1608Metric_Pad0.98x0.95mm_HandSolder]
R11#2  10k  [R_0603_1608Metric_Pad0.98x0.95mm_HandSolder]
R12#2  47k  [R_0603_1608Metric_Pad0.98x0.95mm_HandSolder]
R13#2  10k  [R_0603_1608Metric_Pad0.98x0.95mm_HandSolder]
R14#2  330  [R_0402_1005Metric_Pad0.72x0.64mm_HandSolder]
R15#2  10k  [R_0402_1005Metric_Pad0.72x0.64mm_HandSolder]
R16#2  10k  [R_0402_1005Metric_Pad0.72x0.64mm_HandSolder]
R17#2  4.7k  [R_0603_1608Metric_Pad0.98x0.95mm_HandSolder]
R18#2  4.7k  [R_0603_1608Metric_Pad0.98x0.95mm_HandSolder]
R19#2  4.7k  [R_0603_1608Metric_Pad0.98x0.95mm_HandSolder]
SW1#2  CK_KMS2xxG  [SW_SPST_CK_KMS2xxG]
SW2#2  CK_KMS2xxG  [SW_SPST_CK_KMS2xxG]  (value not drawn)
SW3#2  CK_KMS2xxG  [SW_SPST_CK_KMS2xxG]  (value not drawn)
TH2  Thermistor_NTC  [R_0603_1608Metric_Pad0.98x0.95mm_HandSolder]
U1#3  BQ76920PW  [TSSOP-20_4.4x6.5mm_P0.65mm]
U2#3  SN74LVC1T45DCK  [SOT-23-6_Handsoldering]
U3#3  ~  [JST_GH_SM02B-GHS-TB_1x02-1MP_P1.25mm_Horizontal]
U4#2  ~  [JST_GH_SM02B-GHS-TB_1x02-1MP_P1.25mm_Horizontal]
U5#3  ~  [PinHeader_2x05_P2.54mm_Horizontal]
U6#2  STM32C011F6Px  [TSSOP-20_4.4x6.5mm_P0.65mm]
Y1  Crystal  [NX3215SA-32.768K-STD-MUA-8]  (value not drawn)

### Ports
+3.3V (in), +3.3V (out), +11.1V (in), +11.1V (out), ALERT (bidir), BMS_GND (in), BMS_GND (out), PA0 (bidir), PA1 (bidir), PA2 (bidir), PA3 (bidir), PA5 (bidir), PA6 (bidir), PA11 (bidir), PA12 (bidir), PA13 (bidir), PA14 (in), PA14 (out), PACK+ (in), PACK+ (out), PACK- (in), PACK- (out), PWROFF (in), PWROFF (out), SCL (in), SCL (out), SDA (bidir), SWCLK (in), SWCLK (out), SWDIO (in), SWDIO (out)

### Nets
GND: #FLG02#3.1 C1#2.1 C2#3.1 C3#3.1 C4#3.1 C6#3.1 C7#3.2 C10#1.1 C11#2.1 C12#2.2 C13.2 C14.2 C15.2 J1#2.1 Q3#2.1(G) R1#3.2 R7#2.1 R12#2.2 R15#2.2 SW1#2.SH(B) SW2#2.2 SW2#2.SH(B) SW3#2.SH(B) TH2.1 U1#3.3(VSS) U2#3.2(GND) U6#2.5(VSS) ; port PACK-
PWR_FL: R2#3.1 R13#2.2 SW1#2.1 U1#3.16(VC1) U2#3.1(VCCA)
+3.3V: C10#1.2 C12#2.1 R14#2.1 R16#2.2 R17#2.1 R18#2.1 R19#2.1 U1#3.8(REGOUT) U2#3.6(VCCB) U6#2.4(VDD) ; port +3.3V
+11.1V: J1#2.2 J2#1.2 R8#2.2 U3#3.2 U4#2.2 ; port PACK+, port +11.1V
ALERT: R19#2.2 U1#3.20(ALERT) U6#2.15(PA8) ; port ALERT
BMS_GND: J2#1.1 Q1#2.3(D) R9#2.1 U3#3.1 U4#2.1 ; port BMS_GND
PA0: U5#3.8 U6#2.7(PA0) ; port PA0
PA1: U5#3.7 U6#2.8(PA1) ; port PA1
PA2: U5#3.10 U6#2.9(PA2) ; port PA2
PA3: U5#3.9 U6#2.10(PA3) ; port PA3
PA5: U5#3.1 U6#2.12(PA5) ; port PA5
PA6: U5#3.2 U6#2.13(PA6) ; port PA6
PA11: U5#3.4 U6#2.16(PA9/PA11) ; port PA11
PA12: U5#3.3 U6#2.17(PA10/PA12) ; port PA12
PA13: U5#3.6 U6#2.18(PA13) ; port SWDIO, port PA13
PA14: R15#2.1 SW3#2.2 U5#3.5 U6#2.19(PA14) ; port SWCLK, port PA14
PWROFF: U2#3.4(B) U6#2.14(PA7) ; port PWROFF
SCL: R18#2.2 U1#3.5(SCL) U6#2.20(PB6) ; port SCL
SDA: R17#2.2 U1#3.4(SDA) U6#2.1(PB7) ; port SDA
NetC1#2_2: C1#2.2 U1#3.9(REGSRC)
NetC2#3_2: C2#3.2 U1#3.7(CAP1)
NetC3#3_2: C3#3.2 C5#2.1 R6#2.2 U1#3.19(SRN)
NetC4#3_2: C4#3.2 C5#2.2 R7#2.2 U1#3.18(SRP)
NetC6#3_2: C6#3.2 J3#1.4 R3#3.2
NetC7#3_1: C7#3.1 C8#3.2 J3#1.3 R2#3.2
NetC8#3_1: C8#3.1 C9#3.2 J3#1.2 R4#3.2
NetC9#3_1: C9#3.1 J3#1.1 R5#2.2
NetC11#2_2: C11#2.2 R8#2.1 U1#3.10(BAT)
NetC13_1: C13.1 U6#2.2(PC14) Y1.2
NetC14_1: C14.1 U6#2.3(PC15) Y1.1
NetC15_1: C15.1 SW2#2.1 U6#2.6(PF2)
NetD1#2_1: D1#2.1(K) R11#2.2
NetD1#2_2: D1#2.2(A) R12#2.1 SW1#2.2 U2#3.3(A)
NetD2#2_1: D2#2.1(K) U6#2.11(PA4)
NetD2#2_2: D2#2.2(A) R16#2.1
NetQ1#2_1: Q1#2.1(G) R9#2.2 U1#3.1(DSG)
NetQ1#2_2: Q1#2.2(S) Q2#2.2(S)
NetQ2#2_1: Q2#2.1(G) Q3#2.3(D) R10#2.2
NetQ2#2_3: Q2#2.3(D) R1#3.1 R6#2.1 R10#2.1
NetQ3#2_2: Q3#2.2(S) U1#3.2(CHG)
NetR3#3_1: R3#3.1 U1#3.17(VC0)
NetR4#3_1: R4#3.1 R5#2.1 U1#3.12(VC5) U1#3.13(VC4) U1#3.14(VC3) U1#3.15(VC2)
NetR11#2_1: R11#2.1 TH2.2 U1#3.6(TS1)
NetR13#2_1: R13#2.1 U2#3.5(DIR)
NetR14#2_2: R14#2.2 SW3#2.1

Not connected (* = marked no-connect by the designer): U1#3 11(NC)

### Notes on the sheet
- 1
- 2
- 3
- 4
- 5
- 6
- A
- B
- C
- D
- Title:
- File: BMS.kicad_sch
- Sheet: /
- KiCad E.D.A.  kicad (5.1.4)-1
- Size: A4
- Date:
- Rev:
- Id: 1/1

### Library data of the parts
#FLG02#3 = PWR_FLAG: as #FLG01#1 on sheet Voltage supply of sEMG & ADC; Value: PWR_FLAG
C1#2 C2#3 C3#3 C4#3 C5#2 C6#3 C7#3 C8#3 C9#3 C10#1 C11#2 C12#2 C13-C15 = C: Description: Unpolarized capacitor
  C1#2 C2#3: Website: https://eu.mouser.com/ProductDetail/TDK/C1608X7R1H105K080AB?qs=efUn273yAhdzCWVW9RXgig%3D%3D; Value: 1uF; Footprint: Capacitor_SMD:C_0603_1608Metric_Pad1.08x0.95mm_HandSolder
  C3#3 C4#3 C5#2: Website: https://eu.mouser.com/ProductDetail/Murata-Electronics/GCM188R71H104JA57D?qs=ui%252B2d9lVEI4ebGBmb9XKtA%3D%3D; Value: 0.1uF; Footprint: Capacitor_SMD:C_0603_1608Metric_Pad1.08x0.95mm_HandSolder
  C6#3 C7#3 C8#3 C9#3: Website: http://eu.mouser.com/ProductDetail/Murata-Electronics/GCJ21BR71H105MA01K?qs=QzBtWTOodeVZ%252BTk8SNChEw%3D%3D; Value: 1uF; Footprint: Capacitor_SMD:C_0805_2012Metric_Pad1.18x1.45mm_HandSolder
  C10#1: Website: https://eu.mouser.com/ProductDetail/Murata-Electronics/GCQ1555C1H4R7WB01D?qs=0lQeLiL1qyYRZt16ZY6xZA%3D%3D; Value: 4.7pF; Footprint: Capacitor_SMD:C_0402_1005Metric_Pad0.74x0.62mm_HandSolder
  C11#2: Website: https://www.mouser.bg/ProductDetail/Murata-Electronics/GRM32ER71J106KA12L?qs=eeBpzGFlv%252B%2FlkjOiPI7fBw%3D%3D; Value: 10uF; Footprint: Capacitor_SMD:C_1210_3225Metric_Pad1.33x2.70mm_HandSolder
  C12#2: Website: https://eu.mouser.com/ProductDetail/Murata-Electronics/GCM188R71H104JA57D?qs=ui%252B2d9lVEI4ebGBmb9XKtA%3D%3D; Value: 100nF; Footprint: Capacitor_SMD:C_0402_1005Metric_Pad0.74x0.62mm_HandSolder
  C13 C14: Website: https://eu.mouser.com/ProductDetail/Murata-Electronics/GCM188R71H104JA57D?qs=ui%252B2d9lVEI4ebGBmb9XKtA%3D%3D; Value: 12pF; Footprint: Capacitor_SMD:C_0603_1608Metric_Pad1.08x0.95mm_HandSolder
  C15: Website: https://eu.mouser.com/ProductDetail/Murata-Electronics/GCM188R71H104JA57D?qs=ui%252B2d9lVEI4ebGBmb9XKtA%3D%3D; Value: 0.1uF; Footprint: Capacitor_SMD:C_0402_1005Metric_Pad0.74x0.62mm_HandSolder
D1#2 = 1N4148WT: Description: 75V 0.15A Fast switching Diode, SOD-523; Sim.Device: D; Sim.Pins: 1=K 2=A; Value: 1N4148WT; Footprint: Diode_SMD:D_SOD-523
D2#2 = LED: Description: Light emitting diode; Value: BLUE; Footprint: Diode_SMD:D_0603_1608Metric_Pad1.05x0.95mm_HandSolder
H1#3 H2#3 H3#3 H4#3 = MountingHole: as H1#1 on sheet Voltage supply of sEMG & ADC; Value: MountingHole; Footprint: MountingHole:MountingHole_3.2mm_M3_DIN965
J1#2 = XT60-M: MF: AMASS; Description_1: \n                        \n                            Plug; DC supply; XT60; male; PIN: 2; for cable; soldered; 30A; 500V\n                        \n; MAXIMUM_PACKAGE_HEIGHT: 16.00 mm; Package: Package; Price: None; Check_prices: https://www.snapeda.com/parts/XT60-M/AMASS/view-part/?ref=eda; STANDARD: IPC 7351B; PARTREV: V1.2; SnapEDA_Link: https://www.snapeda.com/parts/XT60-M/AMASS/view-part/?ref=snap; MP: XT60-M; Availability: Not in stock; MANUFACTURER: AMASS; Value: XT60-M; Footprint: Connector_AMASS:AMASS_XT60PW-M_1x02_P7.20mm_Horizontal
J2#1 = XT60-M_1: MF: AMASS; MP: XT60-M; Description_1: \n                        \n                            Plug; DC supply; XT60; male; PIN: 2; for cable; soldered; 30A; 500V\n                        \n; MAXIMUM_PACKAGE_HEIGHT: 16.00 mm; Package: Package; Price: None; Check_prices: https://www.snapeda.com/parts/XT60-M/AMASS/view-part/?ref=eda; STANDARD: IPC 7351B; PARTREV: V1.2; SnapEDA_Link: https://www.snapeda.com/parts/XT60-M/AMASS/view-part/?ref=snap; Availability: Not in stock; MANUFACTURER: AMASS; Value: XT60-F; Footprint: Connector_AMASS:AMASS_XT60PW-F_1x02_P7.20mm_Horizontal
J3#1 = 4-1971800-1: Description: New Gi Conn2.5 Hdr Asmbly 3p Red D1.5, 3-1971800-3; MF: TE Connectivity; Description_1: \n                        \n                            Connector Header Through Hole 4 position 0.098 (2.50mm)\n                        \n; Check_prices: https://www.snapeda.com/parts/4-1971800-1/TE+Connectivity/view-part/?ref=eda; PACKAGE: None; PRICE: None; Package: None; TE_PURCHASE_URL: https://www.te.com/usa-en/product-3-1971800-3.html?te_bu=Cor&te_type=disp&te_campaign=seda_glo_cor-seda-global-disp-prtnr-fy19-seda-model-bom-cta_sma-317_1&elqCampaignId=32493; Price: None; SnapEDA_Link: https://www.snapeda.com/parts/4-1971800-1/TE+Connectivity/view-part/?ref=snap; MP: 4-1971800-1; EU_ROHS_COMPLIANCE: Compliant; Availability: In Stock; AVAILABILITY: Unavailable; Value: 4-1971800-1; Footprint: Connector_JST:JST_XH_S4B-XH-A_1x04_P2.50mm_Horizontal
Q1#2 Q2#2 = 2N7002E: Value: BSC014N04LSIATMA1; Footprint: MOSFET-N:TRANS_BSC014N04LSIATMA1
Q3#2 = BSS84: Description: -0.13A Id, -50V Vds, P-Channel MOSFET, SOT-23; Website: https://eu.mouser.com/ProductDetail/onsemi-Fairchild/BSS84?qs=FOlmdCx%252BAA0e83h5MpSc0g%3D%3D; Value: BSS84; Footprint: Package_TO_SOT_SMD:SOT-23
R1#3 R2#3 R3#3 R4#3 R5#2 R6#2 R7#2 R8#2 R9#2 R10#2 R11#2 R12#2 R13#2 R14#2 R15#2 R16#2 R17#2 R18#2 R19#2 = R: Description: Resistor
  R1#3: Value: R; Footprint: Resistor:R_3920
  R2#3 R3#3 R4#3 R5#2 R6#2 R7#2 R8#2: Website: https://store.comet.bg/Catalogue/Product/36541/; Value: 100; Footprint: Resistor_SMD:R_0402_1005Metric_Pad0.72x0.64mm_HandSolder
  R9#2 R10#2: Website: https://store.comet.bg/Catalogue/Product/4430/; Value: 1M; Footprint: Resistor_SMD:R_0603_1608Metric_Pad0.98x0.95mm_HandSolder
  R11#2 R13#2: Value: 10k; Footprint: Resistor_SMD:R_0603_1608Metric_Pad0.98x0.95mm_HandSolder
  R12#2: Value: 47k; Footprint: Resistor_SMD:R_0603_1608Metric_Pad0.98x0.95mm_HandSolder
  R14#2: Website: https://store.comet.bg/Catalogue/Product/36541/; Value: 330; Footprint: Resistor_SMD:R_0402_1005Metric_Pad0.72x0.64mm_HandSolder
  R15#2 R16#2: Website: https://store.comet.bg/Catalogue/Product/36541/; Value: 10k; Footprint: Resistor_SMD:R_0402_1005Metric_Pad0.72x0.64mm_HandSolder
  R17#2 R18#2 R19#2: Value: 4.7k; Footprint: Resistor_SMD:R_0603_1608Metric_Pad0.98x0.95mm_HandSolder
SW1#2 SW2#2 SW3#2 = CK_KMS2xxG: Description: Microminiature SMT Side Actuated, 4.2 x 2.8 x 1.42mm, without pegs, with shield pin; Value: CK_KMS2xxG; Footprint: Button_Switch_SMD:SW_SPST_CK_KMS2xxG
TH2 = Thermistor_NTC: Description: Temperature dependent resistor, negative temperature coefficient; Value: Thermistor_NTC; Footprint: Resistor_SMD:R_0603_1608Metric_Pad0.98x0.95mm_HandSolder
U1#3 = BQ76920PW: Description: Lithium battery monitor, 3-5 cells, integrated balancing, I2C interface, TSSOP-20; Website: https://www.mouser.bg/ProductDetail/Murata-Electronics/NCP18XH103F03RB?qs=k3rQb2PKXqkF9YvF09qsvw%3D%3D; Value: BQ76920PW; Footprint: Package_SO:TSSOP-20_4.4x6.5mm_P0.65mm
U2#3 = SN74LVC1T45DCK: Description: Single-Bit Dual-Supply Bus Transceiver With Configurable Voltage Translation and 3-State Outputs, SOT-363; Value: SN74LVC1T45DCK; Footprint: Package_TO_SOT_SMD:SOT-23-6_Handsoldering
U3#3 U4#2 = H_2: Value: ~; Footprint: Connector_JST:JST_GH_SM02B-GHS-TB_1x02-1MP_P1.25mm_Horizontal
U5#3 = H_10: Value: ~; Footprint: Connector_PinHeader_2.54mm:PinHeader_2x05_P2.54mm_Horizontal
U6#2 = STM32C011F6Px: Description: STMicroelectronics Arm Cortex-M0+ MCU, 32KB flash, 6KB RAM, 48 MHz, 2.0-3.6V, 18 GPIO, TSSOP20; Value: STM32C011F6Px; Footprint: Package_SO:TSSOP-20_4.4x6.5mm_P0.65mm
Y1 = Crystal: Description: Two pin crystal; Value: Crystal; Footprint: Crystals:NX3215SA-32.768K-STD-MUA-8

## Sheet EMG sensors.SchDoc
size 297 x 209 mm
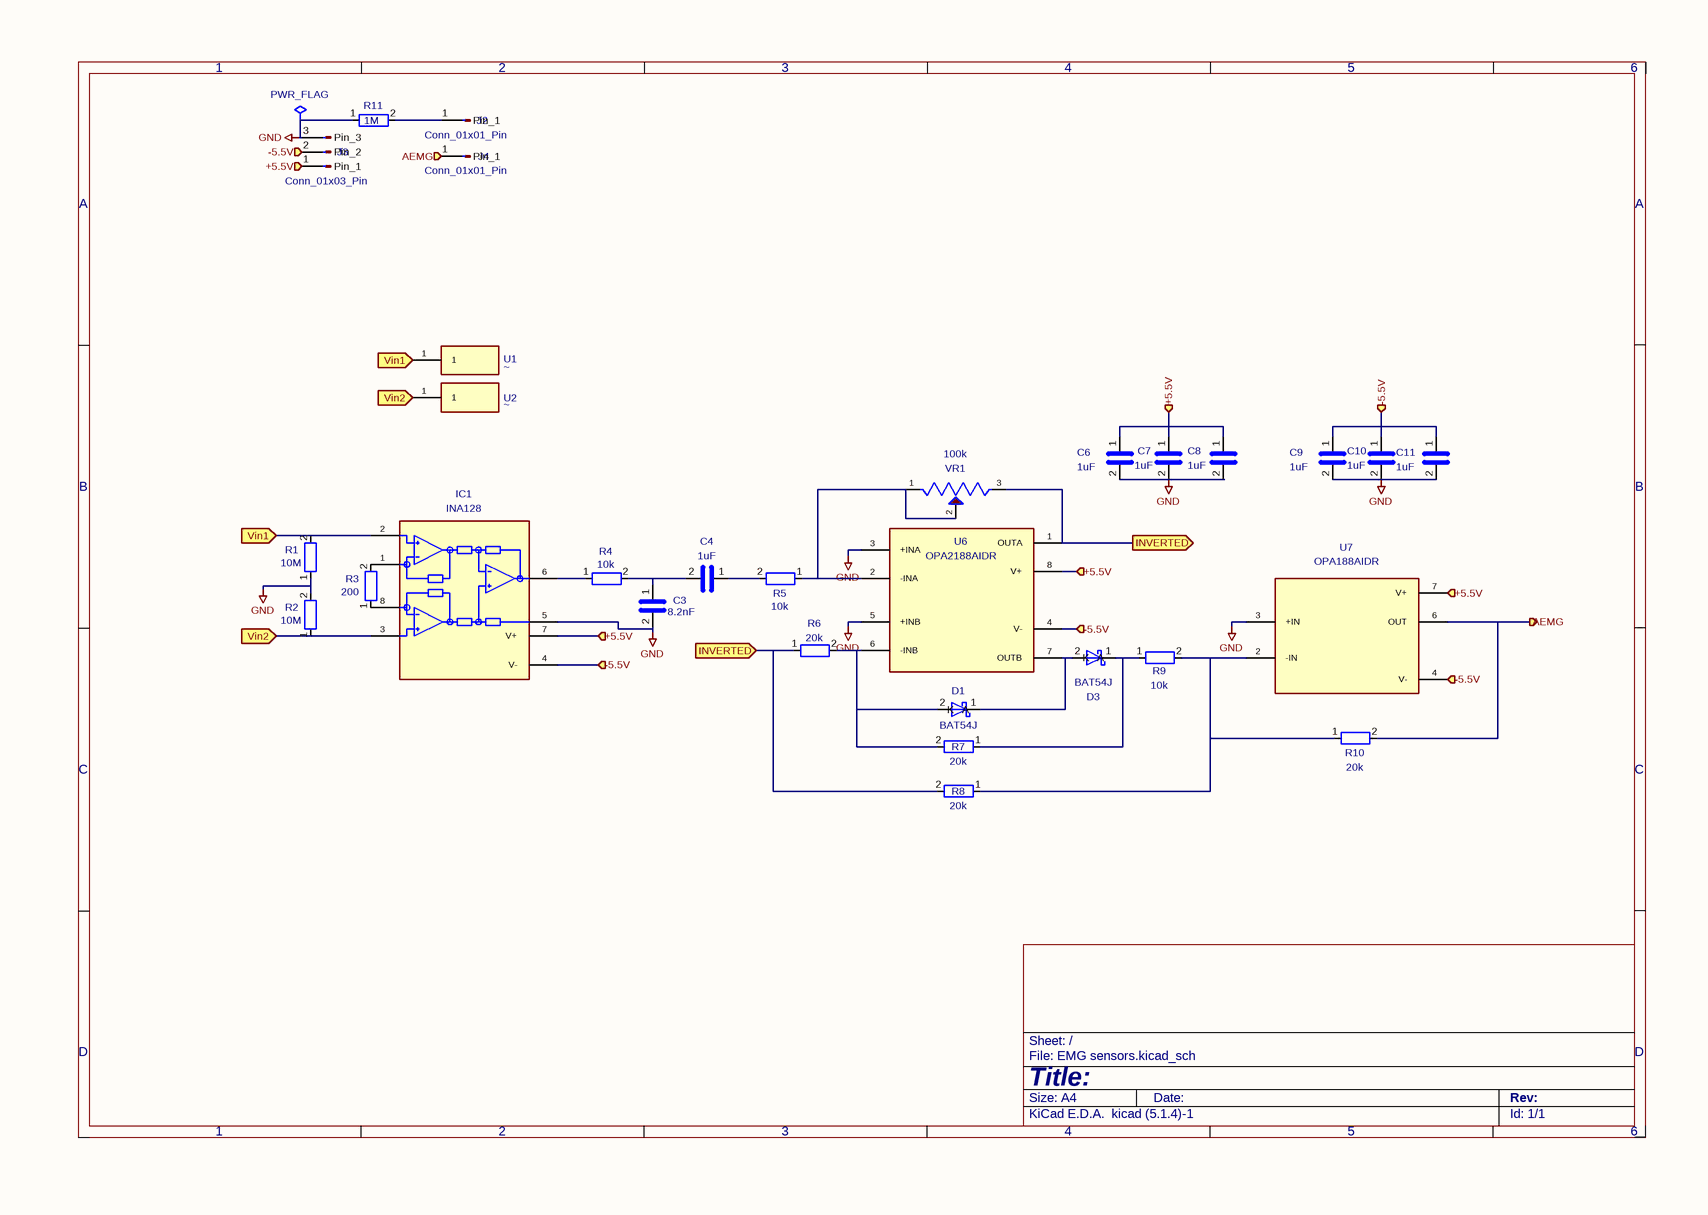
[diagram p3: EMG sensors.SchDoc]

### Parts
(Parts that share a designator on the sheet are numbered #1, #2 ... from top to bottom, then left to right.)
#FLG01#2  PWR_FLAG  (graphical)
C3#4  8.2nF  [C_0603_1608Metric_Pad1.08x0.95mm_HandSolder]
C4#4  1uF  [C_0603_1608Metric_Pad1.08x0.95mm_HandSolder]
C6#4  1uF  [C_0603_1608Metric_Pad1.08x0.95mm_HandSolder]
C7#4  1uF  [C_0603_1608Metric_Pad1.08x0.95mm_HandSolder]
C8#4  1uF  [C_0603_1608Metric_Pad1.08x0.95mm_HandSolder]
C9#4  1uF  [C_0603_1608Metric_Pad1.08x0.95mm_HandSolder]
C10#2  1uF  [C_0603_1608Metric_Pad1.08x0.95mm_HandSolder]
C11#3  1uF  [C_0603_1608Metric_Pad1.08x0.95mm_HandSolder]
D1#3  BAT54J  [D_SOD-323F]
D3#2  BAT54J  [D_SOD-323F]
IC1  INA128  [INA128U]
J2#2  Conn_01x01_Pin  [DIN_Male_1PIN_1.5mm]
J3#2  Conn_01x03_Pin  [JST_GH_SM03B-GHS-TB_1x03-1MP_P1.25mm_Horizontal]
J4  Conn_01x01_Pin  [DIN_Male_1PIN_1.5mm]
R1#4  10M  [R_0603_1608Metric_Pad0.98x0.95mm_HandSolder]
R2#4  10M  [R_0603_1608Metric_Pad0.98x0.95mm_HandSolder]
R3#4  200  [R_0603_1608Metric_Pad0.98x0.95mm_HandSolder]
R4#4  10k  [R_0603_1608Metric_Pad0.98x0.95mm_HandSolder]
R5#3  10k  [R_0603_1608Metric_Pad0.98x0.95mm_HandSolder]
R6#3  20k  [R_0603_1608Metric_Pad0.98x0.95mm_HandSolder]
R7#3  20k  [R_0603_1608Metric_Pad0.98x0.95mm_HandSolder]
R8#3  20k  [R_0603_1608Metric_Pad0.98x0.95mm_HandSolder]
R9#3  10k  [R_0603_1608Metric_Pad0.98x0.95mm_HandSolder]
R10#3  20k  [R_0603_1608Metric_Pad0.98x0.95mm_HandSolder]
R11#3  1M  [R_0603_1608Metric_Pad0.98x0.95mm_HandSolder]
U1#4  ~  [EMG_Snap_4mm]
U2#4  ~  [EMG_Snap_4mm]
U6#3  OPA2188AIDR  [ОПА2188AIDR]
U7#2  OPA188AIDR  [OPA188]
VR1#2  100k  [TRIM_3296W-1-104ALF]

### Ports
+5.5V (in), +5.5V (out), -5.5V (in), -5.5V (out), AEMG (in), AEMG (out), INVERTED (in), INVERTED (out), Vin1 (in), Vin1 (out), Vin2 (in), Vin2 (out)

### Nets
GND: #FLG01#2.1 C3#4.2 C6#4.2 C7#4.2 C8#4.2 C9#4.2 C10#2.2 C11#3.2 IC1.5 J3#2.3(Pin_3) R1#4.1 R2#4.2 R11#3.1 U6#3.3(+INA) U6#3.5(+INB) U7#2.3(+IN)
+5.5V: C6#4.1 C7#4.1 C8#4.1 IC1.7(V+) J3#2.1(Pin_1) U6#3.8(V+) U7#2.7(V+) ; port +5.5V
-5.5V: C9#4.1 C10#2.1 C11#3.1 IC1.4(V-) J3#2.2(Pin_2) U6#3.4(V-) U7#2.4(V-) ; port -5.5V
AEMG: J4.1(Pin_1) R10#3.2 U7#2.6(OUT) ; port AEMG
INVERTED: R6#3.1 R8#3.2 U6#3.1(OUTA) VR1#2.3 ; port INVERTED
Vin1: IC1.2 R1#4.2 U1#4.1 ; port Vin1
Vin2: IC1.3 R2#4.1 U2#4.1 ; port Vin2
NetC3#4_1: C3#4.1 C4#4.2 R4#4.2
NetC4#4_1: C4#4.1 R5#3.2
NetD1#3_1: D1#3.1(K) D3#2.2(A) U6#3.7(OUTB)
NetD1#3_2: D1#3.2(A) R6#3.2 R7#3.2 U6#3.6(-INB)
NetD3#2_1: D3#2.1(K) R7#3.1 R9#3.1
NetIC1_1: IC1.1 R3#4.2
NetIC1_6: IC1.6 R4#4.1
NetIC1_8: IC1.8 R3#4.1
NetJ2#2_1: J2#2.1(Pin_1) R11#3.2
NetR5#3_1: R5#3.1 U6#3.2(-INA) VR1#2.1 VR1#2.2
NetR8#3_1: R8#3.1 R9#3.2 R10#3.1 U7#2.2(-IN)

### Notes on the sheet
- 1
- 2
- 3
- 4
- 5
- 6
- A
- B
- C
- D
- Title:
- File: EMG sensors.kicad_sch
- Sheet: /
- KiCad E.D.A.  kicad (5.1.4)-1
- Size: A4
- Date:
- Rev:
- Id: 1/1

### Library data of the parts
#FLG01#2 = PWR_FLAG: as #FLG01#1 on sheet Voltage supply of sEMG & ADC; Value: PWR_FLAG
C3#4 C4#4 C6#4 C7#4 C8#4 C9#4 C10#2 C11#3 = C: Description: Unpolarized capacitor; Footprint: Capacitor_SMD:C_0603_1608Metric_Pad1.08x0.95mm_HandSolder
  C3#4: Website: https://eu.mouser.com/ProductDetail/KEMET/C0603X822F5JACTU?qs=rKqJIm0tnYHyDiSLXoAHvg%3D%3D; Value: 8.2nF
  C4#4 C6#4 C7#4 C8#4 C9#4 C10#2 C11#3: Website: https://www.digikey.in/en/products/detail/kyocera-avx/KGM15BR71H104JT/1600043; Value: 1uF
D1#3 D3#2 = BAT54J: Description: 30V 200mA Schottky diode, SOD-323F; Value: BAT54J; Footprint: Diode_SMD:D_SOD-323F
IC1 = INA128: MF: Texas Instruments; Description_1: \n                        \n                            Instrumentation Amplifier 1 Circuit - 8-PDIP\n                        \n; Package: DIP-8 Rochester Electronics, LLC; MPN: INA128U; Price: None; OC_FARNELL: 1212413; SnapEDA_Link: https://www.snapeda.com/parts/INA128/Texas+Instruments/view-part/?ref=snap; MP: INA128; OC_NEWARK: 35C1729; Availability: Not in stock; Check_prices: https://www.snapeda.com/parts/INA128/Texas+Instruments/view-part/?ref=eda; Value: INA128; Footprint: OP AMPS:INA128U
J2#2 J4 = Conn_01x01_Pin: Description: Generic connector, single row, 01x01, script generated; Value: Conn_01x01_Pin; Footprint: Connectors:DIN_Male_1PIN_1.5mm
J3#2 = Conn_01x03_Pin: Description: Generic connector, single row, 01x03, script generated; Value: Conn_01x03_Pin; Footprint: Connector_JST:JST_GH_SM03B-GHS-TB_1x03-1MP_P1.25mm_Horizontal
R1#4 R2#4 R3#4 R4#4 R5#3 R6#3 R7#3 R8#3 R9#3 R10#3 R11#3 = R: Description: Resistor; Footprint: Resistor_SMD:R_0603_1608Metric_Pad0.98x0.95mm_HandSolder
  R1#4 R2#4: Website: https://eu.mouser.com/ProductDetail/TE-Connectivity-Holsworthy/RT73F1J200RBTD?qs=sGAEpiMZZMvdGkrng054txLI%2FDB4oIKDBdRkx0ZmGeiYIoSkg5JMIw%3D%3D; Value: 10M
  R3#4: Website: https://eu.mouser.com/ProductDetail/TE-Connectivity-Holsworthy/RT73F1J200RBTD?qs=sGAEpiMZZMvdGkrng054txLI%2FDB4oIKDBdRkx0ZmGeiYIoSkg5JMIw%3D%3D; Value: 200
  R4#4 R5#3 R9#3: Value: 10k
  R6#3 R7#3 R8#3 R10#3: Value: 20k
  R11#3: Value: 1M
U1#4 U2#4 = H_1: Value: ~; Footprint: EMG:EMG_Snap_4mm
U6#3 = OPA2188AIDR: MF: Texas Instruments; Description_1: \n                        \n                            0.03µV/°C, 6µV Vos, Low Noise, Rail-to-Rail Output, 36V Zero-Drift Operational Amplifier\n                        \n; Package: SOIC-8 Texas Instruments; Price: None; SnapEDA_Link: https://www.snapeda.com/parts/OPA2188AIDR/Texas+Instruments/view-part/?ref=snap; MP: OPA2188AIDR; Availability: In Stock; Check_prices: https://www.snapeda.com/parts/OPA2188AIDR/Texas+Instruments/view-part/?ref=eda; Value: OPA2188AIDR; Footprint: OP AMPS:ОПА2188AIDR
U7#2 = OPA188AIDR: MF: Texas Instruments; Description_1: \n                        \n                            Precision, Low-Noise, Rail-to-Rail Output, 36V Zero-Drift Operational Amplifier\n                        \n; Package: SOIC-8 Texas Instruments; Price: None; SnapEDA_Link: https://www.snapeda.com/parts/OPA188AIDR/Texas+Instruments/view-part/?ref=snap; MP: OPA188AIDR; Availability: In Stock; Check_prices: https://www.snapeda.com/parts/OPA188AIDR/Texas+Instruments/view-part/?ref=eda; Value: OPA188AIDR; Footprint: OP AMPS:OPA188
VR1#2 = 3296W-1-104ALF: MF: Bourns; Description_1: \n                        \n                            TRIMMER - 3/8in SQ MT CERMET | Bourns 3296W-1-104ALF\n                        \n; Package: NON STANDARD-3 Bourns; Price: None; Check_prices: https://www.snapeda.com/parts/3296W-1-104ALF/Bourns/view-part/?ref=eda; STANDARD: Manufacturer Recommendation; PARTREV: 05/16; SnapEDA_Link: https://www.snapeda.com/parts/3296W-1-104ALF/Bourns/view-part/?ref=snap; MP: 3296W-1-104ALF; Availability: In Stock; MANUFACTURER: Bourns; Value: 100k; Footprint: Trimmers:TRIM_3296W-1-104ALF

## Nets that join several sheets
GND: Voltage supply of sEMG & ADC (57 pins), ADC (34 pins), BMS (27 pins), EMG sensors (16 pins)
+3.3V: ADC (7 pins), BMS (10 pins)
+5.5V: Voltage supply of sEMG & ADC (5 pins), EMG sensors (7 pins)
+5V: Voltage supply of sEMG & ADC (5 pins), ADC (9 pins)
+11.1V: Voltage supply of sEMG & ADC (6 pins), BMS (5 pins)
-5.5V: Voltage supply of sEMG & ADC (5 pins), EMG sensors (7 pins)